# Altium schematic sheet RK-POWER-SUPPLY.SchDoc
size 420 x 297 mm; SheetNumber: 16; SheetTotal: 32
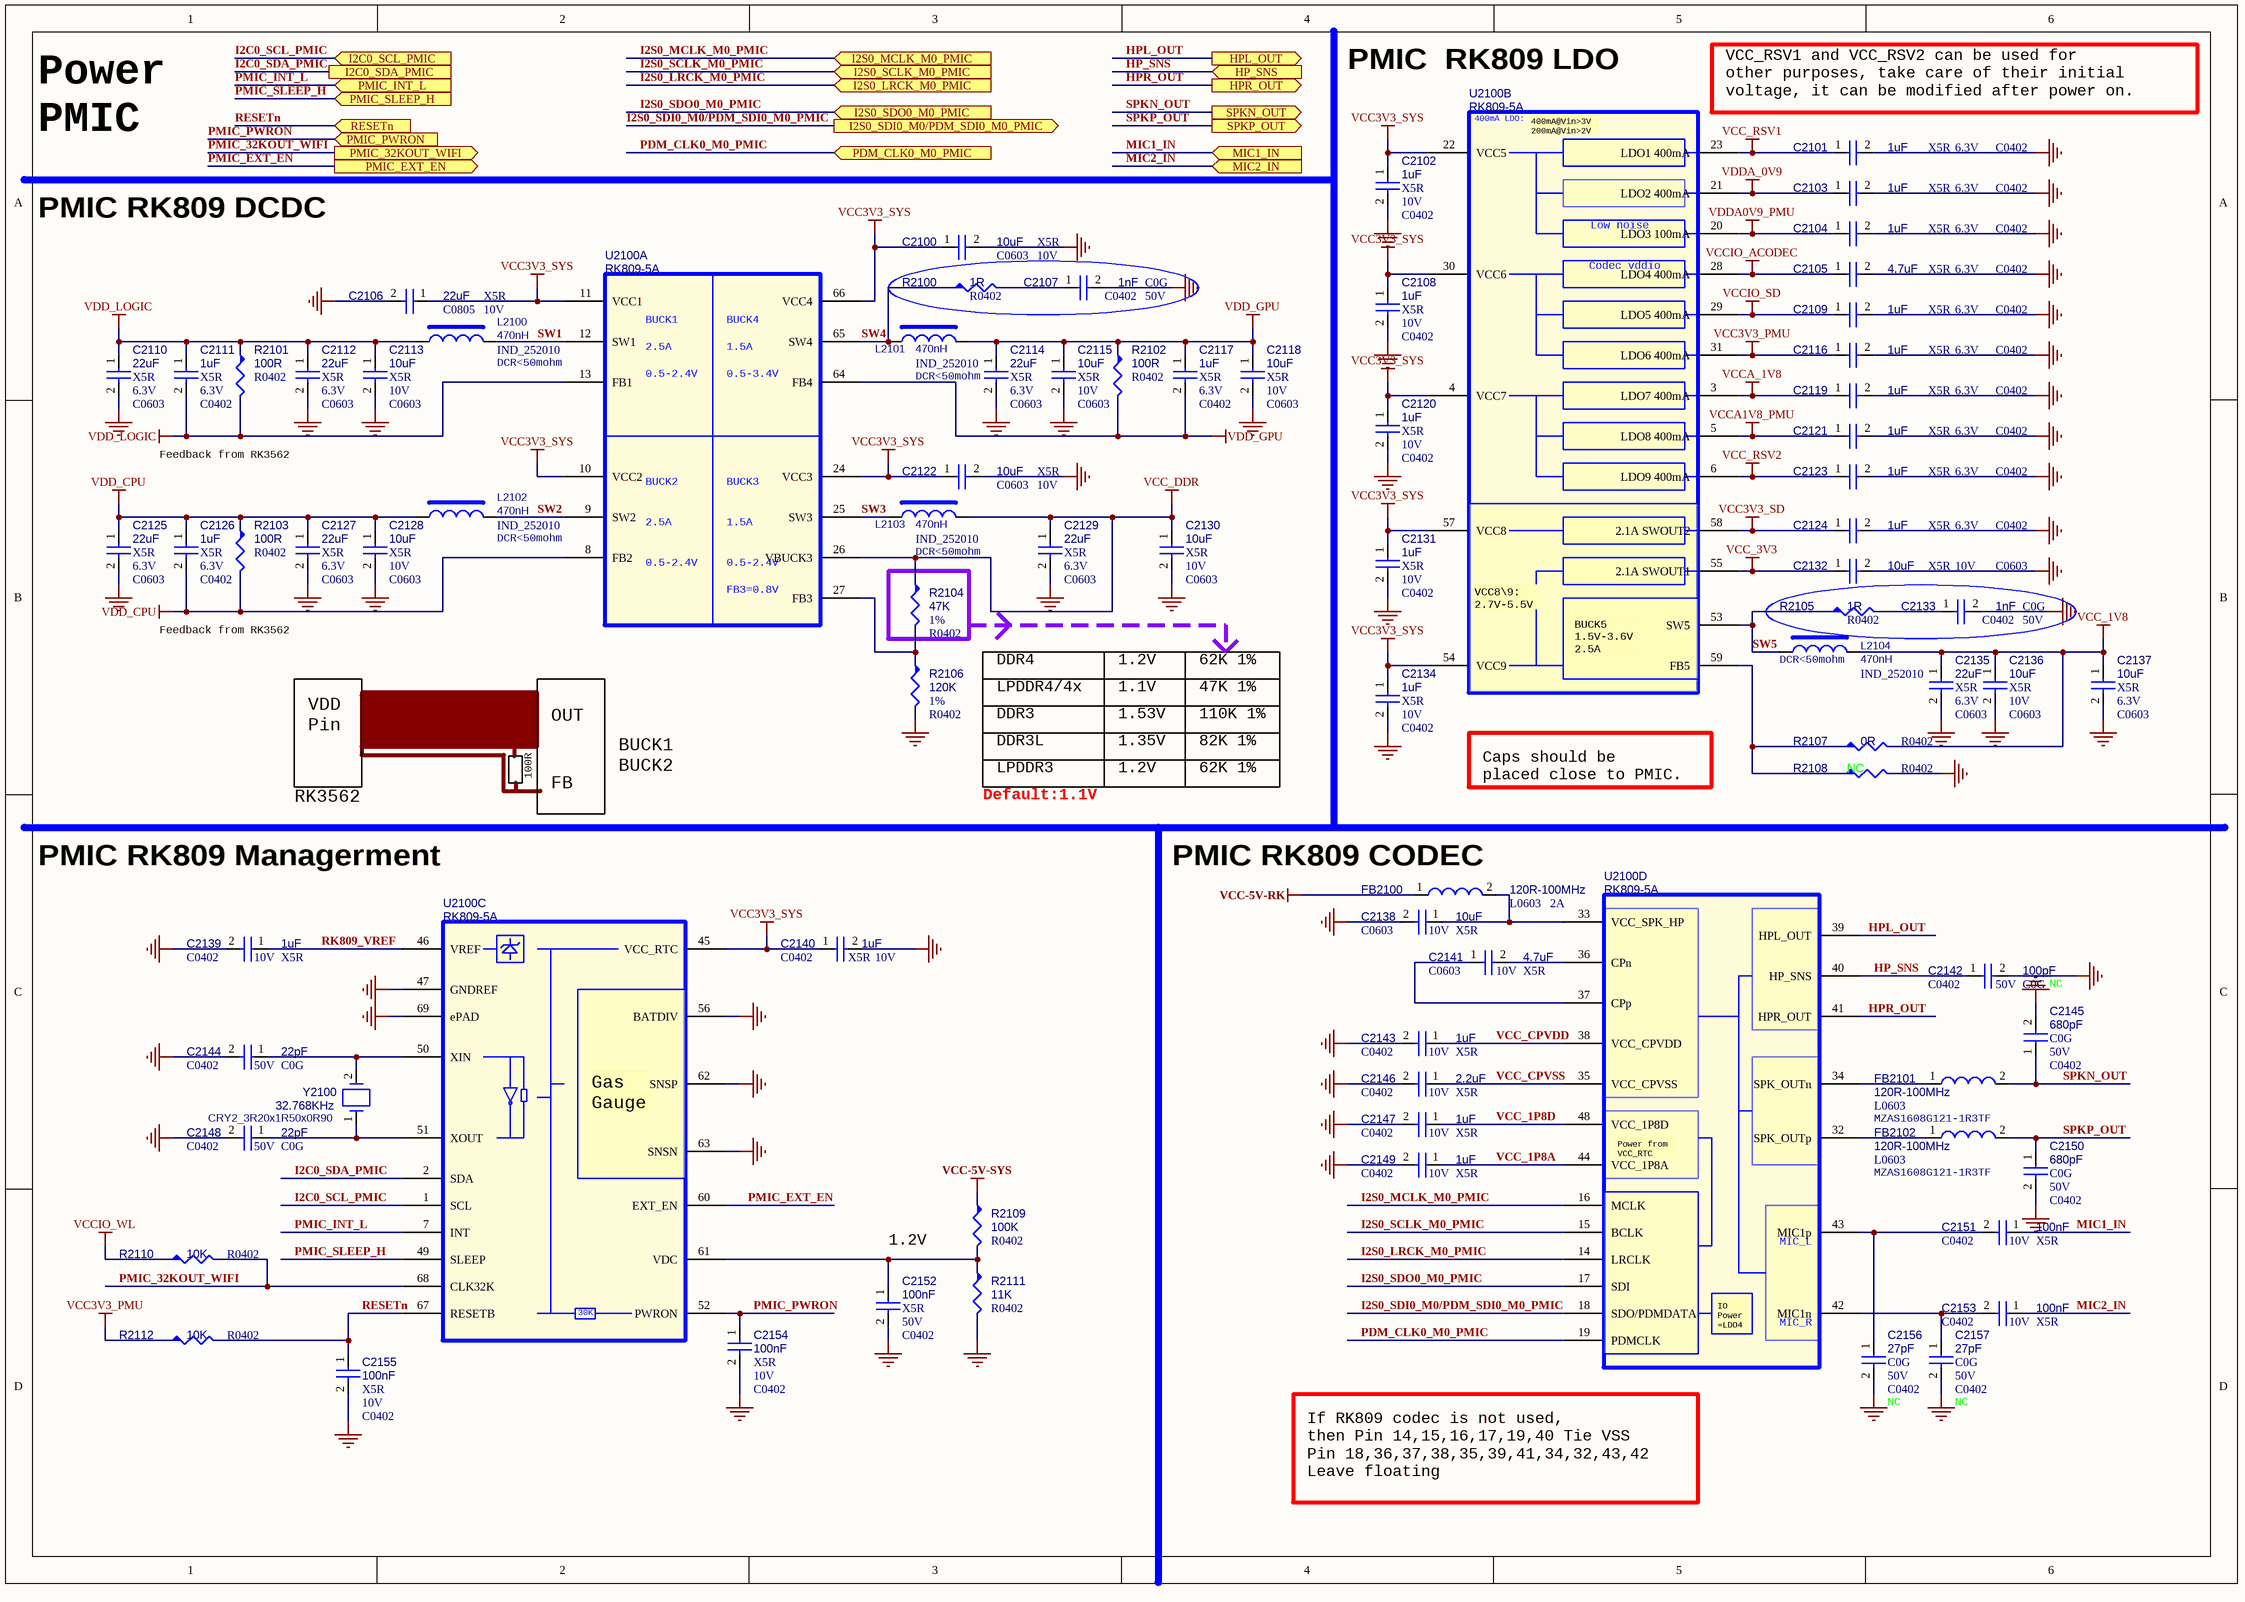
[diagram p0: RK-POWER-SUPPLY.SchDoc]

## Parts
C2100  10uF  Dielectric: X5R  Voltage: 10V  [C0603]
C2101  1uF  Dielectric: X5R  Voltage: 6.3V  [C0402]
C2102  1uF  Dielectric: X5R  Voltage: 10V  [C0402]
C2103  1uF  Dielectric: X5R  Voltage: 6.3V  [C0402]
C2104  1uF  Dielectric: X5R  Voltage: 6.3V  [C0402]
C2105  4.7uF  Dielectric: X5R  Voltage: 6.3V  [C0402]
C2106  22uF  Dielectric: X5R  PCB Footprint: C0805  Voltage: 10V  [CAP-0805-S]
C2107  1nF  Dielectric: C0G  Voltage: 50V  [C0402]
C2108  1uF  Dielectric: X5R  Voltage: 10V  [C0402]
C2109  1uF  Dielectric: X5R  Voltage: 6.3V  [C0402]
C2110  22uF  Dielectric: X5R  Voltage: 6.3V  [C0603]
C2111  1uF  Dielectric: X5R  Voltage: 6.3V  [C0402]
C2112  22uF  Dielectric: X5R  Voltage: 6.3V  [C0603]
C2113  10uF  Dielectric: X5R  Voltage: 10V  [C0603]
C2114  22uF  Dielectric: X5R  Voltage: 6.3V  [C0603]
C2115  10uF  Dielectric: X5R  Voltage: 10V  [C0603]
C2116  1uF  Dielectric: X5R  Voltage: 6.3V  [C0402]
C2117  1uF  Dielectric: X5R  Voltage: 6.3V  [C0402]
C2118  10uF  Dielectric: X5R  Voltage: 10V  [C0603]
C2119  1uF  Dielectric: X5R  Voltage: 6.3V  [C0402]
C2120  1uF  Dielectric: X5R  Voltage: 10V  [C0402]
C2121  1uF  Dielectric: X5R  Voltage: 6.3V  [C0402]
C2122  10uF  Dielectric: X5R  Voltage: 10V  [C0603]
C2123  1uF  Dielectric: X5R  Voltage: 6.3V  [C0402]
C2124  1uF  Dielectric: X5R  Voltage: 6.3V  [C0402]
C2125  22uF  Dielectric: X5R  Voltage: 6.3V  [C0603]
C2126  1uF  Dielectric: X5R  Voltage: 6.3V  [C0402]
C2127  22uF  Dielectric: X5R  Voltage: 6.3V  [C0603]
C2128  10uF  Dielectric: X5R  Voltage: 10V  [C0603]
C2129  22uF  Dielectric: X5R  Voltage: 6.3V  [C0603]
C2130  10uF  Dielectric: X5R  Voltage: 10V  [C0603]
C2131  1uF  Dielectric: X5R  Voltage: 10V  [C0402]
C2132  10uF  Dielectric: X5R  Voltage: 10V  [C0603]
C2133  1nF  Dielectric: C0G  Voltage: 50V  [C0402]
C2134  1uF  Dielectric: X5R  Voltage: 10V  [C0402]
C2135  22uF  Dielectric: X5R  Voltage: 6.3V  [C0603]
C2136  10uF  Dielectric: X5R  Voltage: 10V  [C0603]
C2137  10uF  Dielectric: X5R  Voltage: 6.3V  [C0603]
C2138  10uF  Dielectric: X5R  Voltage: 10V  [C0603]
C2139  1uF  Dielectric: X5R  Voltage: 10V  [C0402]
C2140  1uF  Dielectric: X5R  Voltage: 10V  [C0402]
C2141  4.7uF  Dielectric: X5R  Voltage: 10V  [C0603]
C2142  100pF  Dielectric: C0G  Voltage: 50V  Option: NC  [C0402]
C2143  1uF  Dielectric: X5R  Voltage: 10V  [C0402]
C2144  22pF  Dielectric: C0G  Voltage: 50V  [C0402]
C2145  680pF  Dielectric: C0G  Voltage: 50V  [C0402]
C2146  2.2uF  Dielectric: X5R  Voltage: 10V  [C0402]
C2147  1uF  Dielectric: X5R  Voltage: 10V  [C0402]
C2148  22pF  Dielectric: C0G  Voltage: 50V  [C0402]
C2149  1uF  Dielectric: X5R  Voltage: 10V  [C0402]
C2150  680pF  Dielectric: C0G  Voltage: 50V  [C0402]
C2151  100nF  Dielectric: X5R  Voltage: 10V  [C0402]
C2152  100nF  Dielectric: X5R  Voltage: 50V  [C0402]
C2153  100nF  Dielectric: X5R  Voltage: 10V  [C0402]
C2154  100nF  Dielectric: X5R  Voltage: 10V  [C0402]
C2155  100nF  Dielectric: X5R  Voltage: 10V  [C0402]
C2156  27pF  Dielectric: C0G  Voltage: 50V  Option: NC  [C0402]
C2157  27pF  Dielectric: C0G  Voltage: 50V  Option: NC  [C0402]
FB2100  120R-100MHz  Irms: 2A  [L0603]
FB2101  120R-100MHz  Manufacturer PN: MZAS1608G121-1R3TF  [L0603]
FB2102  120R-100MHz  Manufacturer PN: MZAS1608G121-1R3TF  [L0603]
L2100  470nH  option: DCR<50mohm  [IND_252010]
L2101  470nH  option: DCR<50mohm  [IND_252010]
L2102  470nH  option: DCR<50mohm  [IND_252010]
L2103  470nH  option: DCR<50mohm  [IND_252010]
L2104  470nH  option: DCR<50mohm  [IND_252010]
R2100  1R  [R0402]
R2101  100R  [R0402]
R2102  100R  [R0402]
R2103  100R  [R0402]
R2104  47K  Tolerance: 1%  [R0402]
R2105  1R  [R0402]
R2106  120K  Tolerance: 1%  [R0402]
R2107  0R  [R0402]
R2108  NC  [R0402]
R2109  100K  [R0402]
R2110  10K  [R0402]
R2111  11K  [R0402]
R2112  10K  [R0402]
U2100  RK809-5A  [QFN-68_L7.0-W7.0-P0.35-BL-EP5.5]  (parts A,B,C,D of 4)
Y2100  32.768KHz  [CRY2_3R20x1R50x0R90]

## Ports
HP_SNS (in, see CONTROLLER-RK3562[1C]), HPL_OUT (out, see CONTROLLER-RK3562[1C]), HPR_OUT (out, see CONTROLLER-RK3562[1C]), I2C0_SCL_PMIC (in, see CONTROLLER-RK3562[2C], RK3562-PMUIO-OSC-PLL[5B]), I2C0_SDA_PMIC (see CONTROLLER-RK3562[2C], RK3562-PMUIO-OSC-PLL[5B]), I2S0_LRCK_M0_PMIC (in, see CONTROLLER-RK3562[2C], RK3562-VCCIO1[4B]), I2S0_MCLK_M0_PMIC (in, see CONTROLLER-RK3562[2C], RK3562-VCCIO1[4B]), I2S0_SCLK_M0_PMIC (in, see CONTROLLER-RK3562[2C], RK3562-VCCIO1[4B]), I2S0_SDI0_M0/PDM_SDI0_M0_PMIC (out, see CONTROLLER-RK3562[2C], RK3562-VCCIO1[4C]), I2S0_SDO0_M0_PMIC (in, see CONTROLLER-RK3562[2C], RK3562-VCCIO1[4B]), MIC1_IN (in, see CONTROLLER-RK3562[1C], SPEAKER-MIC[1C]), MIC2_IN (in, see CONTROLLER-RK3562[1C], SPEAKER-MIC[1D]), PDM_CLK0_M0_PMIC (in, see CONTROLLER-RK3562[2C], RK3562-VCCIO1[4B]), PMIC_32KOUT_WIFI (out, see CONTROLLER-RK3562[2C], CONTROLLER-RK3562[1B], WF-BT-AP6256[1B]), PMIC_EXT_EN (out, see CONTROLLER-RK3562[1C], BMS-SYSTEM-POWER[1D], CONTROLLER-RK3562[1B]), PMIC_INT_L (in, see CONTROLLER-RK3562[2C], RK3562-PMUIO-OSC-PLL[5B]), PMIC_PWRON (in, see CONTROLLER-RK3562[2C], CONTROLLER-RK3562[1B], STM32G070RBT6[2B]), PMIC_SLEEP_H (in, see CONTROLLER-RK3562[2C], RK3562-PMUIO-OSC-PLL[5B]), RESETn (in, see CONTROLLER-RK3562[1C], RK3562-PMUIO-OSC-PLL[6A]), SPKN_OUT (out, see CONTROLLER-RK3562[1C]), SPKP_OUT (out, see CONTROLLER-RK3562[1C])

## Nets
GND: C2100.2 C2101.2 C2102.2 C2103.2 C2104.2 C2105.2 C2106.2 C2107.2 C2108.2 C2109.2 C2110.2 C2112.2 C2113.2 C2114.2 C2115.2 C2116.2 C2118.2 C2119.2 C2120.2 C2121.2 C2122.2 C2123.2 C2124.2 C2125.2 C2127.2 C2128.2 C2129.2 C2130.2 C2131.2 C2132.2 C2133.2 C2134.2 C2135.2 C2136.2 C2137.2 C2138.2 C2139.2 C2140.2 C2142.2 C2143.2 C2144.2 C2145.2 C2146.2 C2147.2 C2148.2 C2149.2 C2150.2 C2152.2 C2154.2 C2155.2 C2156.2 C2157.2 R2106.2 R2108.2 R2111.2 U2100.47(GNDREF) U2100.56(BATDIV) U2100.62(SNSP) U2100.63(SNSN) U2100.69(ePAD)
VCC3V3_PMU: C2116.1 R2112.1 U2100.31(LDO6_400mA)
VCC3V3_SD: C2124.1 U2100.58(2.1A_SWOUT2)
VCC3V3_SYS: C2100.1 C2102.1 C2106.1 C2108.1 C2120.1 C2122.1 C2131.1 C2134.1 C2140.1 U2100.4(VCC7) U2100.10(VCC2) U2100.11(VCC1) U2100.22(VCC5) U2100.24(VCC3) U2100.30(VCC6) U2100.45(VCC_RTC) U2100.54(VCC9) U2100.57(VCC8) U2100.66(VCC4)
VCC-5V-RK: FB2100.1
VCC-5V-SYS: R2109.1
VCC_1V8: C2135.1 C2136.1 C2137.1 L2104.1 R2107.2
VCC_3V3: C2132.1 U2100.55(2.1A_SWOUT1)
VCC_DDR: C2129.1 C2130.1 L2103.1 R2104.1 U2100.26(VBUCK3)
VCC_RSV1: C2101.1 U2100.23(LDO1_400mA)
VCC_RSV2: C2123.1 U2100.6(LDO9_400mA)
VCCA1V8_PMU: C2121.1 U2100.5(LDO8_400mA)
VCCA_1V8: C2119.1 U2100.3(LDO7_400mA)
VCCIO_ACODEC: C2105.1 U2100.28(LDO4_400mA)
VCCIO_SD: C2109.1 U2100.29(LDO5_400mA)
VCCIO_WL: R2110.1
VDD_CPU: C2125.1 C2126.1 C2126.2 C2127.1 C2128.1 L2102.2 R2103.1 R2103.2 U2100.8(FB2)
VDD_GPU: C2114.1 C2115.1 C2117.1 C2117.2 C2118.1 L2101.1 R2102.1 R2102.2 U2100.64(FB4)
VDD_LOGIC: C2110.1 C2111.1 C2111.2 C2112.1 C2113.1 L2100.2 R2101.1 R2101.2 U2100.13(FB1)
VDDA0V9_PMU: C2104.1 U2100.20(LDO3_100mA)
VDDA_0V9: C2103.1 U2100.21(LDO2_400mA)
HP_SNS: C2142.1 U2100.40(HP_SNS) ; port HP_SNS
HPL_OUT: U2100.39(HPL_OUT) ; port HPL_OUT
HPR_OUT: U2100.41(HPR_OUT) ; port HPR_OUT
I2C0_SCL_PMIC: U2100.1(SCL) ; port I2C0_SCL_PMIC
I2C0_SDA_PMIC: U2100.2(SDA) ; port I2C0_SDA_PMIC
I2S0_LRCK_M0_PMIC: U2100.14(LRCLK) ; port I2S0_LRCK_M0_PMIC
I2S0_MCLK_M0_PMIC: U2100.16(MCLK) ; port I2S0_MCLK_M0_PMIC
I2S0_SCLK_M0_PMIC: U2100.15(BCLK) ; port I2S0_SCLK_M0_PMIC
I2S0_SDI0_M0/PDM_SDI0_M0_PMIC: U2100.18(SDO/PDMDATA) ; port I2S0_SDI0_M0/PDM_SDI0_M0_PMIC
I2S0_SDO0_M0_PMIC: U2100.17(SDI) ; port I2S0_SDO0_M0_PMIC
MIC1_IN: C2151.1 ; port MIC1_IN
MIC2_IN: C2153.1 ; port MIC2_IN
PDM_CLK0_M0_PMIC: U2100.19(PDMCLK) ; port PDM_CLK0_M0_PMIC
PMIC_32KOUT_WIFI: R2110.2 U2100.68(CLK32K) ; port PMIC_32KOUT_WIFI
PMIC_EXT_EN: U2100.60(EXT_EN) ; port PMIC_EXT_EN
PMIC_INT_L: U2100.7(INT) ; port PMIC_INT_L
PMIC_PWRON: C2154.1 U2100.52(PWRON) ; port PMIC_PWRON
PMIC_SLEEP_H: U2100.49(SLEEP) ; port PMIC_SLEEP_H
RESETn: C2155.1 R2112.2 U2100.67(RESETB) ; port RESETn
RK809_VREF: C2139.1 U2100.46(VREF)
SPKN_OUT: C2145.1 FB2101.2 ; port SPKN_OUT
SPKP_OUT: C2150.1 FB2102.2 ; port SPKP_OUT
SW1: L2100.1 U2100.12(SW1)
SW2: L2102.1 U2100.9(SW2)
SW3: L2103.2 U2100.25(SW3)
SW4: L2101.2 R2100.1 U2100.65(SW4)
SW5: L2104.2 R2105.1 U2100.53(SW5)
VCC_1P8A: C2149.1 U2100.44(VCC_1P8A)
VCC_1P8D: C2147.1 U2100.48(VCC_1P8D)
VCC_CPVDD: C2143.1 U2100.38(VCC_CPVDD)
VCC_CPVSS: C2146.1 U2100.35(VCC_CPVSS)
NetC2107_1: C2107.1 R2100.2
NetC2133_1: C2133.1 R2105.2
NetC2138_1: C2138.1 FB2100.2 U2100.33(VCC_SPK_HP)
NetC2141_1: C2141.1 U2100.37(CPp)
NetC2141_2: C2141.2 U2100.36(CPn)
NetC2144_1: C2144.1 U2100.50(XIN) Y2100.2
NetC2148_1: C2148.1 U2100.51(XOUT) Y2100.1
NetC2151_2: C2151.2 C2156.1 U2100.43(MIC1p)
NetC2152_1: C2152.1 R2109.2 R2111.1 U2100.61(VDC)
NetC2153_2: C2153.2 C2157.1 U2100.42(MIC1n)
NetFB2101_1: FB2101.1 U2100.34(SPK_OUTn)
NetFB2102_1: FB2102.1 U2100.32(SPK_OUTp)
NetR2104_2: R2104.2 R2106.1 U2100.27(FB3)
NetR2107_1: R2107.1 R2108.1 U2100.59(FB5)

## Notes on the sheet
- PMIC  RK809 LDO
- VCC_RSV1 and VCC_RSV2 can be used for
  other purposes, take care of their initial
  voltage, it can be modified after power on.
- Power
  PMIC
- PMIC RK809 DCDC
- Feedback from RK3562
- DDR4
- 1.2V
- 62K 1%
- VDD
  Pin
- OUT
- LPDDR4/4x
- DDR3
- 1.1V
- 1.53V
- 47K 1%
- 110K 1%
- RK3562
- 100R
- FB
- BUCK1
  BUCK2
- Default:1.1V
- DDR3L
- LPDDR3
- 1.35V
- 82K 1%
- Caps should be
  placed close to PMIC.
- PMIC RK809 Managerment
- PMIC RK809 CODEC
- If RK809 codec is not used,
  then Pin 14,15,16,17,19,40 Tie VSS
  Pin 18,36,37,38,35,39,41,34,32,43,42
  Leave floating
- (in symbol PMIC_RK809, part A) BUCK1; BUCK4; 2.5A; 1.5A; 0.5-2.4V; 0.5-3.4V; BUCK2; BUCK3; FB3=0.8V
- (in symbol PMIC_RK809, part B) 400mA LDO:; 400mA@Vin>3V / 200mA@Vin>2V /; Low noise; Codec vddio; VCC8\9: / 2.7V-5.5V; BUCK5 / 1.5V-3.6V / 2.5A
- (in symbol PMIC_RK809, part C) Gas / Gauge; 30K
- (in symbol PMIC_RK809, part D) Power from / VCC_RTC; MIC_L; IO / Power / =LDO4; MIC_R

## Library data of the parts
C2100 = CAP NP: cap,10.00uF,+/-10%,10V,X5R,C0603; Part Reference: C2100; Manufacturer PN: C1608X5R1A106K080AC; Manufacturer: TDK; Tolerance: 10%; Priority: A; PCB Footprint: C0603; Value: 10uF; Created by: JJJ; Part Type: C0603; RK PN: C1608X5R1A106K080AC
C2101 = CAP NP: cap,1.00uF,+/-10%,6.3V,X5R,C0402; Part Reference: C2101; Manufacturer: TDK; RK PN: C1005X5R0J105K050BB; Priority: A; Tolerance: 10%; PCB Footprint: C0402; Value: 1uF; Part Type: C0402; Manufacturer PN: C1005X5R0J105K050BB; Created by: JJJ
C2102 = CAP NP: cap,1.00uF,+/-10%,10V,X5R,C0402; Part Reference: C2102; Manufacturer: TDK; RK PN: C1005X5R1A105K050BB; Priority: A; Tolerance: 10%; PCB Footprint: C0402; Value: 1uF; Part Type: C0402; Manufacturer PN: C1005X5R1A105K050BB; Created by: JJJ
C2103 = CAP NP: cap,1.00uF,+/-10%,6.3V,X5R,C0402; Part Reference: C2103; Manufacturer: TDK; RK PN: C1005X5R0J105K050BB; Priority: A; Tolerance: 10%; PCB Footprint: C0402; Value: 1uF; Part Type: C0402; Manufacturer PN: C1005X5R0J105K050BB; Created by: JJJ
C2104 = CAP NP: cap,1.00uF,+/-10%,6.3V,X5R,C0402; Part Reference: C2104; Manufacturer: TDK; RK PN: C1005X5R0J105K050BB; Priority: A; Tolerance: 10%; PCB Footprint: C0402; Value: 1uF; Part Type: C0402; Manufacturer PN: C1005X5R0J105K050BB; Created by: JJJ
C2105 = CAP NP: cap,4.70uF,+/-10%,6.3V,X5R,C0402; Part Reference: C2105; Manufacturer PN: C1005X5R0J475K050BC; Manufacturer: TDK; Tolerance: 10%; Priority: A; PCB Footprint: C0402; Value: 4.7uF; Created by: JJJ; Part Type: C0402; RK PN: C1005X5R0J475K050BC
C2106 = CAP NP: cap,22.00uF,+/-10%,10V,X5R,C0805; Part Reference: C2106; Manufacturer PN: C2012X5R1A226K125AB; Manufacturer: TDK; Tolerance: 10%; Priority: A; Value: 22uF; Created by: JJJ; Part Type: C0805; RK PN: C2012X5R1A226K125AB
C2107 = CAP NP: 一般用片状陶瓷电容(GRM),cap,1nF,±5%,50V,C0G,C0402; Part Reference: C2107; Manufacturer: murata; Manufacturer PN: GRM1555C1H102JA01; RK PN: 902006462; Priority: A; PCB Footprint: C0402; Value: 1nF; Part Type: 一般用片状陶瓷电容; Tolerance: ±5%; Created by: JJJ
C2108 = CAP NP: cap,1.00uF,+/-10%,10V,X5R,C0402; Part Reference: C2108; Manufacturer: TDK; RK PN: C1005X5R1A105K050BB; Priority: A; Tolerance: 10%; PCB Footprint: C0402; Value: 1uF; Part Type: C0402; Manufacturer PN: C1005X5R1A105K050BB; Created by: JJJ
C2109 = CAP NP: cap,1.00uF,+/-10%,6.3V,X5R,C0402; Part Reference: C2109; Manufacturer: TDK; RK PN: C1005X5R0J105K050BB; Priority: A; Tolerance: 10%; PCB Footprint: C0402; Value: 1uF; Part Type: C0402; Manufacturer PN: C1005X5R0J105K050BB; Created by: JJJ
C2110 = CAP NP: cap,22.00uF,+/-20%,6.3V,X5R,C0603; Part Reference: C2110; Manufacturer: TDK; RK PN: C1608X5R0J226M080AC; Priority: A; Tolerance: 20%; PCB Footprint: C0603; Value: 22uF; Part Type: C0603; Manufacturer PN: C1608X5R0J226M080AC; Created by: JJJ
C2111 = CAP NP: cap,1.00uF,+/-10%,6.3V,X5R,C0402; Part Reference: C2111; Manufacturer PN: C1005X5R0J105K050BB; Manufacturer: TDK; Tolerance: 10%; Priority: A; PCB Footprint: C0402; Value: 1uF; Created by: JJJ; Part Type: C0402; RK PN: C1005X5R0J105K050BB
C2112 = CAP NP: cap,22.00uF,+/-20%,6.3V,X5R,C0603; Part Reference: C2112; Manufacturer: TDK; RK PN: C1608X5R0J226M080AC; Priority: A; Tolerance: 20%; PCB Footprint: C0603; Value: 22uF; Part Type: C0603; Manufacturer PN: C1608X5R0J226M080AC; Created by: JJJ
C2113 = CAP NP: cap,10.00uF,+/-10%,10V,X5R,C0603; Part Reference: C2113; Manufacturer: TDK; RK PN: C1608X5R1A106K080AC; Priority: A; Tolerance: 10%; PCB Footprint: C0603; Value: 10uF; Part Type: C0603; Manufacturer PN: C1608X5R1A106K080AC; Created by: JJJ
C2114 = CAP NP: cap,22.00uF,+/-20%,6.3V,X5R,C0603; Part Reference: C2114; Manufacturer PN: C1608X5R0J226M080AC; Manufacturer: TDK; Tolerance: 20%; Priority: A; PCB Footprint: C0603; Value: 22uF; Created by: JJJ; Part Type: C0603; RK PN: C1608X5R0J226M080AC
C2115 = CAP NP: cap,10.00uF,+/-10%,10V,X5R,C0603; Part Reference: C2115; Manufacturer PN: C1608X5R1A106K080AC; Manufacturer: TDK; Tolerance: 10%; Priority: A; PCB Footprint: C0603; Value: 10uF; Created by: JJJ; Part Type: C0603; RK PN: C1608X5R1A106K080AC
C2116 = CAP NP: cap,1.00uF,+/-10%,6.3V,X5R,C0402; Part Reference: C2116; Manufacturer: TDK; RK PN: C1005X5R0J105K050BB; Priority: A; Tolerance: 10%; PCB Footprint: C0402; Value: 1uF; Part Type: C0402; Manufacturer PN: C1005X5R0J105K050BB; Created by: JJJ
C2117 = CAP NP: cap,1.00uF,+/-10%,6.3V,X5R,C0402; Part Reference: C2117; Manufacturer PN: C1005X5R0J105K050BB; Manufacturer: TDK; Tolerance: 10%; Priority: A; PCB Footprint: C0402; Value: 1uF; Created by: JJJ; Part Type: C0402; RK PN: C1005X5R0J105K050BB
C2118 = CAP NP: cap,10.00uF,+/-10%,10V,X5R,C0603; Part Reference: C2118; Manufacturer PN: C1608X5R1A106K080AC; Manufacturer: TDK; Tolerance: 10%; Priority: A; PCB Footprint: C0603; Value: 10uF; Created by: JJJ; Part Type: C0603; RK PN: C1608X5R1A106K080AC
C2119 = CAP NP: cap,1.00uF,+/-10%,6.3V,X5R,C0402; Part Reference: C2119; Manufacturer: TDK; RK PN: C1005X5R0J105K050BB; Priority: A; Tolerance: 10%; PCB Footprint: C0402; Value: 1uF; Part Type: C0402; Manufacturer PN: C1005X5R0J105K050BB; Created by: JJJ
C2120 = CAP NP: cap,1.00uF,+/-10%,10V,X5R,C0402; Part Reference: C2120; Manufacturer: TDK; RK PN: C1005X5R1A105K050BB; Priority: A; Tolerance: 10%; PCB Footprint: C0402; Value: 1uF; Part Type: C0402; Manufacturer PN: C1005X5R1A105K050BB; Created by: JJJ
C2121 = CAP NP: cap,1.00uF,+/-10%,6.3V,X5R,C0402; Part Reference: C2121; Manufacturer: TDK; RK PN: C1005X5R0J105K050BB; Priority: A; Tolerance: 10%; PCB Footprint: C0402; Value: 1uF; Part Type: C0402; Manufacturer PN: C1005X5R0J105K050BB; Created by: JJJ
C2122 = CAP NP: cap,10.00uF,+/-10%,10V,X5R,C0603; Part Reference: C2122; Manufacturer PN: C1608X5R1A106K080AC; Manufacturer: TDK; Tolerance: 10%; Priority: A; PCB Footprint: C0603; Value: 10uF; Created by: JJJ; Part Type: C0603; RK PN: C1608X5R1A106K080AC
C2123 = CAP NP: cap,1.00uF,+/-10%,6.3V,X5R,C0402; Part Reference: C2123; Manufacturer: TDK; RK PN: C1005X5R0J105K050BB; Priority: A; Tolerance: 10%; PCB Footprint: C0402; Value: 1uF; Part Type: C0402; Manufacturer PN: C1005X5R0J105K050BB; Created by: JJJ
C2124 = CAP NP: cap,1.00uF,+/-10%,6.3V,X5R,C0402; Part Reference: C2124; Manufacturer: TDK; RK PN: C1005X5R0J105K050BB; Priority: A; Tolerance: 10%; PCB Footprint: C0402; Value: 1uF; Part Type: C0402; Manufacturer PN: C1005X5R0J105K050BB; Created by: JJJ
C2125 = CAP NP: cap,22.00uF,+/-20%,6.3V,X5R,C0603; Part Reference: C2125; Manufacturer: TDK; RK PN: C1608X5R0J226M080AC; Priority: A; Tolerance: 20%; PCB Footprint: C0603; Value: 22uF; Part Type: C0603; Manufacturer PN: C1608X5R0J226M080AC; Created by: JJJ
C2126 = CAP NP: cap,1.00uF,+/-10%,6.3V,X5R,C0402; Part Reference: C2126; Manufacturer: TDK; RK PN: C1005X5R0J105K050BB; Priority: A; Tolerance: 10%; PCB Footprint: C0402; Value: 1uF; Part Type: C0402; Manufacturer PN: C1005X5R0J105K050BB; Created by: JJJ
C2127 = CAP NP: cap,22.00uF,+/-20%,6.3V,X5R,C0603; Part Reference: C2127; Manufacturer: TDK; RK PN: C1608X5R0J226M080AC; Priority: A; Tolerance: 20%; PCB Footprint: C0603; Value: 22uF; Part Type: C0603; Manufacturer PN: C1608X5R0J226M080AC; Created by: JJJ
C2128 = CAP NP: cap,10.00uF,+/-10%,10V,X5R,C0603; Part Reference: C2128; Manufacturer PN: C1608X5R1A106K080AC; Manufacturer: TDK; Tolerance: 10%; Priority: A; PCB Footprint: C0603; Value: 10uF; Created by: JJJ; Part Type: C0603; RK PN: C1608X5R1A106K080AC
C2129 = CAP NP: cap,22.00uF,+/-20%,6.3V,X5R,C0603; Part Reference: C2129; Manufacturer: TDK; RK PN: C1608X5R0J226M080AC; Priority: A; Tolerance: 20%; PCB Footprint: C0603; Value: 22uF; Part Type: C0603; Manufacturer PN: C1608X5R0J226M080AC; Created by: JJJ
C2130 = CAP NP: cap,10.00uF,+/-10%,10V,X5R,C0603; Part Reference: C2130; Manufacturer PN: C1608X5R1A106K080AC; Manufacturer: TDK; Tolerance: 10%; Priority: A; PCB Footprint: C0603; Value: 10uF; Created by: JJJ; Part Type: C0603; RK PN: C1608X5R1A106K080AC
C2131 = CAP NP: cap,1.00uF,+/-10%,10V,X5R,C0402; Part Reference: C2131; Manufacturer: TDK; RK PN: C1005X5R1A105K050BB; Priority: A; Tolerance: 10%; PCB Footprint: C0402; Value: 1uF; Part Type: C0402; Manufacturer PN: C1005X5R1A105K050BB; Created by: JJJ
C2132 = CAP NP: cap,10.00uF,+/-10%,10V,X5R,C0603; Part Reference: C2132; Manufacturer PN: C1608X5R1A106K080AC; Manufacturer: TDK; Tolerance: 10%; Priority: A; PCB Footprint: C0603; Value: 10uF; Created by: JJJ; Part Type: C0603; RK PN: C1608X5R1A106K080AC
C2133 = CAP NP: 一般用片状陶瓷电容(GRM),cap,1nF,±5%,50V,C0G,C0402; Part Reference: C2133; Manufacturer PN: GRM1555C1H102JA01; Manufacturer: murata; Priority: A; RK PN: 902006462; PCB Footprint: C0402; Value: 1nF; Created by: JJJ; Tolerance: ±5%; Part Type: 一般用片状陶瓷电容
C2134 = CAP NP: cap,1.00uF,+/-10%,10V,X5R,C0402; Part Reference: C2134; Manufacturer: TDK; RK PN: C1005X5R1A105K050BB; Priority: A; Tolerance: 10%; PCB Footprint: C0402; Value: 1uF; Part Type: C0402; Manufacturer PN: C1005X5R1A105K050BB; Created by: JJJ
C2135 = CAP NP: cap,22.00uF,+/-20%,6.3V,X5R,C0603; Part Reference: C2135; Manufacturer: TDK; RK PN: C1608X5R0J226M080AC; Priority: A; Tolerance: 20%; PCB Footprint: C0603; Value: 22uF; Part Type: C0603; Manufacturer PN: C1608X5R0J226M080AC; Created by: JJJ
C2136 = CAP NP: cap,10.00uF,+/-10%,10V,X5R,C0603; Part Reference: C2136; Manufacturer: TDK; RK PN: C1608X5R1A106K080AC; Priority: A; Tolerance: 10%; PCB Footprint: C0603; Value: 10uF; Part Type: C0603; Manufacturer PN: C1608X5R1A106K080AC; Created by: JJJ
C2137 = CAP NP: 一般用片状陶瓷电容(GRM),cap,10uF,±10%,6.3V,X5R,C0603; Part Reference: C2137; Manufacturer: murata; Manufacturer PN: GRM188R60J106KE47; RK PN: 902006684; Priority: A; PCB Footprint: C0603; Value: 10uF; Part Type: 一般用片状陶瓷电容; Tolerance: ±10%; Created by: JJJ
C2138 = CAP NP: cap,10.00uF,+/-10%,10V,X5R,C0603; Part Reference: C2138; Manufacturer PN: C1608X5R1A106K080AC; Manufacturer: TDK; Tolerance: 10%; Priority: A; PCB Footprint: C0603; Value: 10uF; Created by: JJJ; Part Type: C0603; RK PN: C1608X5R1A106K080AC
C2139 = CAP NP: cap,1.00uF,+/-10%,10V,X5R,C0402; Part Reference: C2139; Manufacturer PN: C1005X5R1A105K050BB; Manufacturer: TDK; Tolerance: 10%; Priority: A; PCB Footprint: C0402; Value: 1uF; Created by: JJJ; Part Type: C0402; RK PN: C1005X5R1A105K050BB
C2140 = CAP NP: cap,1.00uF,+/-10%,10V,X5R,C0402; Part Reference: C2140; Manufacturer PN: C1005X5R1A105K050BB; Manufacturer: TDK; Tolerance: 10%; Priority: A; PCB Footprint: C0402; Value: 1uF; Created by: JJJ; Part Type: C0402; RK PN: C1005X5R1A105K050BB
C2141 = CAP NP: cap,4.70uF,+/-10%,10V,X5R,C0603; Part Reference: C2141; Manufacturer: TDK; Number: 37; RK PN: C1608X5R1A475K080AC; Priority: A; Tolerance: 10%; C_Voltage: 6.3V; PCB Footprint: C0603; Value: 4.7uF; Part Type: C0603; Manufacturer PN: C1608X5R1A475K080AC; Created by: JJJ
C2142 = CAP NP: cap,100.00pF,+/-10%,50V,C0G,C0402; Part Reference: C2142; Manufacturer PN: C1005C0G1H101K050BA; Manufacturer: TDK; Tolerance: 10%; Priority: A; PCB Footprint: C0402; Value: 100pF; Created by: JJJ; Part Type: C0402; RK PN: C1005C0G1H101K050BA
C2143 = CAP NP: cap,1.00uF,+/-10%,10V,X5R,C0402; Part Reference: C2143; Manufacturer PN: C1005X5R1A105K050BB; Manufacturer: TDK; Tolerance: 10%; Priority: A; PCB Footprint: C0402; Value: 1uF; Created by: JJJ; Part Type: C0402; RK PN: C1005X5R1A105K050BB
C2144 = CAP NP: cap,22.00pF,+/-1%,50V,C0G,C0402; Part Reference: C2144; Manufacturer PN: C1005C0G1H220F050BA; Manufacturer: TDK; Tolerance: 1%; Priority: A; PCB Footprint: C0402; Value: 22pF; Created by: JJJ; Part Type: C0402; RK PN: C1005C0G1H220F050BA
C2145 = CAP NP: cap,680.00pF,+/-5%,50V,C0G,C0402; Part Reference: C2145; Manufacturer PN: C1005C0G1H681J050BA; Manufacturer: TDK; Tolerance: 5%; Priority: A; PCB Footprint: C0402; Value: 680pF; Created by: JJJ; Part Type: C0402; RK PN: C1005C0G1H681J050BA
C2146 = CAP NP: cap,2.20uF,+/-10%,10V,X5R,C0402; Part Reference: C2146; Manufacturer: TDK; RK PN: C1005X5R1A225K050BC; Priority: A; Tolerance: 10%; PCB Footprint: C0402; Value: 2.2uF; Part Type: C0402; Manufacturer PN: C1005X5R1A225K050BC; Created by: JJJ
C2147 = CAP NP: cap,1.00uF,+/-10%,10V,X5R,C0402; Part Reference: C2147; Manufacturer PN: C1005X5R1A105K050BB; Manufacturer: TDK; Tolerance: 10%; Priority: A; PCB Footprint: C0402; Value: 1uF; Created by: JJJ; Part Type: C0402; RK PN: C1005X5R1A105K050BB
C2148 = CAP NP: cap,22.00pF,+/-1%,50V,C0G,C0402; Part Reference: C2148; Manufacturer PN: C1005C0G1H220F050BA; Manufacturer: TDK; Tolerance: 1%; Priority: A; PCB Footprint: C0402; Value: 22pF; Created by: JJJ; Part Type: C0402; RK PN: C1005C0G1H220F050BA
C2149 = CAP NP: cap,1.00uF,+/-10%,10V,X5R,C0402; Part Reference: C2149; Manufacturer: TDK; RK PN: C1005X5R1A105K050BB; Priority: A; Tolerance: 10%; PCB Footprint: C0402; Value: 1uF; Part Type: C0402; Manufacturer PN: C1005X5R1A105K050BB; Created by: JJJ
C2150 = CAP NP: cap,680.00pF,+/-5%,50V,C0G,C0402; Part Reference: C2150; Manufacturer PN: C1005C0G1H681J050BA; Manufacturer: TDK; Tolerance: 5%; Priority: A; PCB Footprint: C0402; Value: 680pF; Created by: JJJ; Part Type: C0402; RK PN: C1005C0G1H681J050BA
C2151 = CAP NP: cap,100.00nF,+/-10%,10V,X5R,C0402; Part Reference: C2151; Manufacturer: TDK; RK PN: C1005X5R1A104K050BA; Priority: A; Tolerance: 10%; PCB Footprint: C0402; Value: 100nF; Part Type: C0402; Manufacturer PN: C1005X5R1A104K050BA; Created by: JJJ
C2152 = CAP NP: 一般用片状陶瓷电容(GRM),cap,100nF,±10%,50V,X5R,C0402; Part Reference: C2152; Manufacturer PN: GRM155R61H104KE19; Manufacturer: murata; Priority: A; RK PN: 902000085; PCB Footprint: C0402; Value: 100nF; Created by: JJJ; Tolerance: ±10%; Part Type: 一般用片状陶瓷电容
C2153 = CAP NP: cap,100.00nF,+/-10%,10V,X5R,C0402; Part Reference: C2153; Manufacturer PN: C1005X5R1A104K050BA; Manufacturer: TDK; Tolerance: 10%; Priority: A; PCB Footprint: C0402; Value: 100nF; Created by: JJJ; Part Type: C0402; RK PN: C1005X5R1A104K050BA
C2154 = CAP NP: cap,100.00nF,+/-10%,10V,X5R,C0402; Part Reference: C2154; Manufacturer PN: C1005X5R1A104K050BA; Manufacturer: TDK; Tolerance: 10%; Priority: A; PCB Footprint: C0402; Value: 100nF; Created by: JJJ; Part Type: C0402; RK PN: C1005X5R1A104K050BA
C2155 = CAP NP: cap,100.00nF,+/-10%,10V,X5R,C0402; Part Reference: C2155; Manufacturer PN: C1005X5R1A104K050BA; Manufacturer: TDK; Tolerance: 10%; Priority: A; PCB Footprint: C0402; Value: 100nF; Created by: JJJ; Part Type: C0402; RK PN: C1005X5R1A104K050BA
C2156 = CAP NP: cap,27.00pF,+/-5%,50V,C0G,C0402; Part Reference: C2156; Manufacturer: TDK; RK PN: C1005C0G1H270J050BA; Priority: A; Tolerance: 5%; PCB Footprint: C0402; Value: 27pF; Part Type: C0402; Manufacturer PN: C1005C0G1H270J050BA; Created by: JJJ
C2157 = CAP NP: cap,27.00pF,+/-5%,50V,C0G,C0402; Part Reference: C2157; Manufacturer PN: C1005C0G1H270J050BA; Manufacturer: TDK; Tolerance: 5%; Priority: A; PCB Footprint: C0402; Value: 27pF; Created by: JJJ; Part Type: C0402; RK PN: C1005C0G1H270J050BA
FB2100 = BEAD: BEAD,120R@100MHz,current=2000mA,0603; Part Reference: FB2100; Manufacturer: Murata; DC Resistor: 0.030ohm; Tolerance: 25%; RK PN: BLM18KG121TN1; Priority: L; PCB Footprint: L0603; Value: 120R-100MHz; Part Type: BEAD; Manufacturer PN: BLM18KG121TN1; Created by: DZS
FB2101 = BEAD: BEAD,120R@100MHz,current=2000mA,0603; Part Reference: FB2101; Manufacturer: SUNLORD; DC Resistor: 0.030ohm; Tolerance: 25%; Irms: 2A; RK PN: BLM18KG121TN1; Priority: L; PCB Footprint: L0603; Value: 120R-100MHz; Part Type: BEAD; Created by: DZS
FB2102 = BEAD: BEAD,120R@100MHz,current=2000mA,0603; Part Reference: FB2102; Manufacturer: SUNLORD; DC Resistor: 0.030ohm; Tolerance: 25%; Irms: 2A; Priority: L; RK PN: BLM18KG121TN1; PCB Footprint: L0603; Value: 120R-100MHz; Created by: DZS; Part Type: BEAD
L2100 = INDUCTORS OF FERRITE: Power Inductor,470nH,0.2,IND_252010; Part Reference: L2100; Manufacturer PN: VLS252010HBX-R47M; Manufacturer: TDK; Isat: 4.53A; DC Resistor: 0.035ohm; Resonace frequency: 1MHz; Irms: 3.32A; Tolerance: 20%; Priority: A; PCB Footprint: IND_252010; Value: 470nH; Created by: CDH; Part Type: POWER_IND; RK PN: VLS252010HBX-R47M
L2101 = INDUCTORS OF FERRITE: Power Inductor,470nH,0.2,IND_252010; Part Reference: L2101; Manufacturer PN: VLS252010HBX-R47M; Manufacturer: TDK; Isat: 4.53A; DC Resistor: 0.035ohm; Resonace frequency: 1MHz; Irms: 3.32A; Tolerance: 20%; Priority: A; PCB Footprint: IND_252010; Value: 470nH; Created by: CDH; Part Type: POWER_IND; RK PN: VLS252010HBX-R47M
L2102 = INDUCTORS OF FERRITE: Power Inductor,470nH,0.2,IND_252010; Part Reference: L2102; Manufacturer PN: VLS252010HBX-R47M; Manufacturer: TDK; Isat: 4.53A; DC Resistor: 0.035ohm; Resonace frequency: 1MHz; Irms: 3.32A; Tolerance: 20%; Priority: A; PCB Footprint: IND_252010; Value: 470nH; Created by: CDH; Part Type: POWER_IND; RK PN: VLS252010HBX-R47M
L2103 = INDUCTORS OF FERRITE: Power Inductor,470nH,0.2,IND_252010; Part Reference: L2103; Manufacturer PN: VLS252010HBX-R47M; Manufacturer: TDK; Isat: 4.53A; DC Resistor: 0.035ohm; Resonace frequency: 1MHz; Irms: 3.32A; Tolerance: 20%; Priority: A; PCB Footprint: IND_252010; Value: 470nH; Created by: CDH; Part Type: POWER_IND; RK PN: VLS252010HBX-R47M
L2104 = INDUCTORS OF FERRITE: Power Inductor,470nH,0.2,IND_252010; Part Reference: L2104; Manufacturer: TDK; Isat: 4.53A; DC Resistor: 0.035ohm; RK PN: VLS252010HBX-R47M; Priority: A; Tolerance: 20%; Irms: 3.32A; Resonace frequency: 1MHz; PCB Footprint: IND_252010; Value: 470nH; Part Type: POWER_IND; Manufacturer PN: VLS252010HBX-R47M; Created by: CDH
R2100 = RESISTOR5: 通用厚膜电阻,1R,+/-5%,R0402,1/16W.; Part Reference: R2100; Manufacturer PN: RC0402JR-071RL; Manufacturer: YAGEO; Tolerance: 5%; Wattage: 1/16W; Priority: A; RK PN: 901001495; PCB Footprint: R0402; Value: 1R; Created by: YTL; Part Type: 通用厚膜电阻
R2101 = RESISTOR5: 通用厚膜电阻,100R,+/-5%,R0402,1/16W.; Part Reference: R2101; Manufacturer PN: RC0402JR-07100RL; Manufacturer: YAGEO; Tolerance: 5%; Wattage: 1/16W; Priority: A; RK PN: 901001448; PCB Footprint: R0402; Value: 100R; Created by: YTL; Part Type: 通用厚膜电阻
R2102 = RESISTOR5: 通用厚膜电阻,100R,+/-5%,R0402,1/16W.; Part Reference: R2102; Manufacturer PN: RC0402JR-07100RL; Manufacturer: YAGEO; Tolerance: 5%; Wattage: 1/16W; Priority: A; RK PN: 901001448; PCB Footprint: R0402; Value: 100R; Created by: YTL; Part Type: 通用厚膜电阻
R2103 = RESISTOR5: 通用厚膜电阻,100R,+/-5%,R0402,1/16W.; Part Reference: R2103; Manufacturer PN: RC0402JR-07100RL; Manufacturer: YAGEO; Tolerance: 5%; Wattage: 1/16W; Priority: A; RK PN: 901001448; PCB Footprint: R0402; Value: 100R; Created by: YTL; Part Type: 通用厚膜电阻
R2104 = RESISTOR1: 通用厚膜电阻,47K,+/-1%,R0402,1/16W.; Part Reference: R2104; Manufacturer PN: RC0402FR-0747KL; Manufacturer: YAGEO; Wattage: 1/16W; Priority: A; RK PN: 901001211; PCB Footprint: R0402; Value: 47K; Created by: YTL; Part Type: 通用厚膜电阻
R2105 = RESISTOR5: 通用厚膜电阻,1R,+/-5%,R0402,1/16W.; Part Reference: R2105; Manufacturer PN: RC0402JR-071RL; Manufacturer: YAGEO; Tolerance: 5%; Wattage: 1/16W; Priority: A; RK PN: 901001495; PCB Footprint: R0402; Value: 1R; Created by: YTL; Part Type: 通用厚膜电阻
R2106 = RESISTOR1: 通用厚膜电阻,120K,+/-1%,R0402,1/16W.; Part Reference: R2106; Manufacturer: YAGEO; Manufacturer PN: RC0402FR-07120KL; RK PN: 901000798; Priority: A; Wattage: 1/16W; PCB Footprint: R0402; Value: 120K; Part Type: 通用厚膜电阻; Created by: YTL
R2107 = RESISTOR5: 通用厚膜电阻,0R,+/-5%,R0402,1/16W.; Part Reference: R2107; Manufacturer PN: RC0402JR-070RL; Manufacturer: YAGEO; Tolerance: 5%; Wattage: 1/16W; Priority: A; RK PN: 901001446; PCB Footprint: R0402; Value: 0R; Created by: YTL; Part Type: 通用厚膜电阻
R2108 = RESISTOR5_NC: NC电阻，无阻值.; Part Reference: R2108; RK PN: 901006427-1; Priority: A; Optional: X; PCB Footprint: R0402; Value: NC; Part Type: NC电阻; Created by: JJJ
R2109 = RESISTOR5: 通用厚膜电阻,100K,+/-5%,R0402,1/16W.; Part Reference: R2109; Manufacturer: YAGEO; Manufacturer PN: RC0402JR-07100KL; Tolerance: 5%; RK PN: 901001447; Priority: A; Wattage: 1/16W; PCB Footprint: R0402; Value: 100K; Part Type: 通用厚膜电阻; Created by: YTL
R2110 = RESISTOR5: 通用厚膜电阻,10K,+/-5%,R0402,1/16W.; Part Reference: R2110; Manufacturer PN: RC0402JR-0710KL; Manufacturer: YAGEO; Tolerance: 5%; Wattage: 1/16W; Priority: A; RK PN: 901001449; PCB Footprint: R0402; Value: 10K; Created by: YTL; Part Type: 通用厚膜电阻
R2111 = RESISTOR5: 通用厚膜电阻,11K,+/-5%,R0402,1/16W.; Part Reference: R2111; Manufacturer: YAGEO; Manufacturer PN: RC0402JR-0711KL; Tolerance: 5%; RK PN: 901001454; Priority: A; Wattage: 1/16W; PCB Footprint: R0402; Value: 11K; Part Type: 通用厚膜电阻; Created by: YTL
R2112 = RESISTOR5: 通用厚膜电阻,10K,+/-5%,R0402,1/16W.; Part Reference: R2112; Manufacturer PN: RC0402JR-0710KL; Manufacturer: YAGEO; Tolerance: 5%; Wattage: 1/16W; Priority: A; RK PN: 901001449; PCB Footprint: R0402; Value: 10K; Created by: YTL; Part Type: 通用厚膜电阻
U2100 = PMIC_RK809: ROCKCHIP PMIC RK809-5A; Part Reference: U2100; Manufacturer: Rockchip (瑞芯微); RK PN: 998000114; Priority: A; PCB Footprint: QFN68_7R00X7R00X0R80_T; Value: RK809-5A; Part Type: PMIC; Manufacturer PN: RK809-5A; Created by: JJJ
Y2100 = CRYSTAL_2P: 无源晶振，32.768KHz,±20ppm，12.5pF; Part Reference: Y2100; Manufacturer: TKD(泰晶); RK PN: SF-3215; Priority: A; PCB Footprint: CRY2_3R20x1R50x0R90; Value: 32.768KHz; Part Type: CRYSTAL; Manufacturer PN: SF-3215; Created by: YWQ